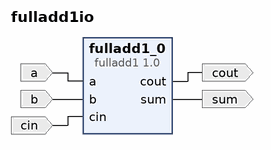
[diagram p0: block diagram of the top level]
# Vivado block design fulladd1io, xc7a35tcsg324-1, Vivado 2018.3
create_bd_design fulladd1io

create_bd_port -dir I a
create_bd_port -dir I b
create_bd_port -dir I cin
create_bd_port -dir O sum
create_bd_port -dir O cout

create_bd_cell -type ip -vlnv xilinx.com:user:fulladd1:1.0 fulladd1_0

# ---- connections ----

connect_bd_net [get_bd_ports a] [get_bd_pins fulladd1_0/a]
connect_bd_net [get_bd_ports b] [get_bd_pins fulladd1_0/b]
connect_bd_net [get_bd_ports cin] [get_bd_pins fulladd1_0/cin]
connect_bd_net [get_bd_pins fulladd1_0/sum] [get_bd_ports sum]
connect_bd_net [get_bd_pins fulladd1_0/cout] [get_bd_ports cout]

validate_bd_design
save_bd_design
